# Altium schematic sheet sensors.SchDoc
size A4; SheetNumber: 5; SheetTotal: 6
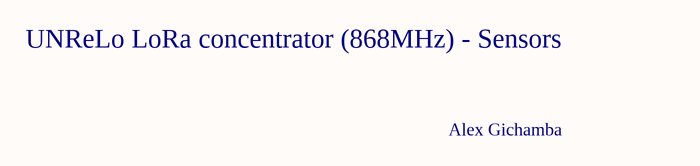
[diagram p0: sensors.SchDoc]

## Notes on the sheet
- UNReLo LoRa concentrator (868MHz) - Sensors
- Alex Gichamba